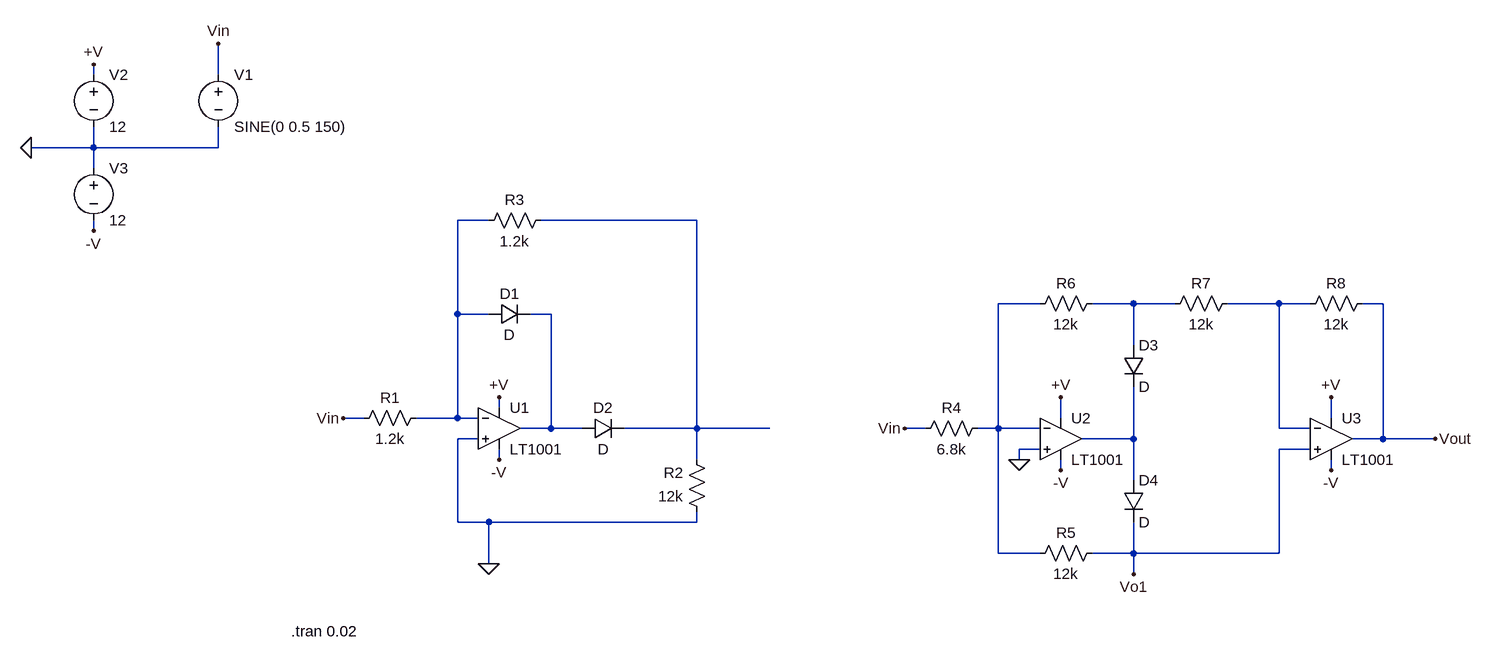
[diagram p0: schematic ckt.asc]
ckt.asc, the LTspice schematic file:
Version 4
SHEET 1 1720 680
WIRE -416 -448 -416 -464
WIRE -224 -448 -224 -496
WIRE -416 -336 -416 -368
WIRE -416 -336 -512 -336
WIRE -224 -336 -224 -368
WIRE -224 -336 -416 -336
WIRE -416 -304 -416 -336
WIRE 192 -224 144 -224
WIRE 512 -224 272 -224
WIRE -416 -208 -416 -224
WIRE 1040 -96 976 -96
WIRE 1184 -96 1120 -96
WIRE 1248 -96 1184 -96
WIRE 1408 -96 1328 -96
WIRE 1456 -96 1408 -96
WIRE 1568 -96 1536 -96
WIRE 144 -80 144 -224
WIRE 192 -80 144 -80
WIRE 288 -80 256 -80
WIRE 1184 -32 1184 -96
WIRE 208 64 208 48
WIRE 0 80 -32 80
WIRE 144 80 144 -80
WIRE 144 80 80 80
WIRE 176 80 144 80
WIRE 1072 80 1072 48
WIRE 1488 80 1488 48
WIRE 288 96 288 -80
WIRE 288 96 240 96
WIRE 336 96 288 96
WIRE 512 96 512 -224
WIRE 512 96 400 96
WIRE 624 96 512 96
WIRE 864 96 832 96
WIRE 976 96 976 -96
WIRE 976 96 944 96
WIRE 1040 96 976 96
WIRE 1408 96 1408 -96
WIRE 1456 96 1408 96
WIRE 176 112 144 112
WIRE 1184 112 1184 32
WIRE 1184 112 1104 112
WIRE 1568 112 1568 -96
WIRE 1568 112 1520 112
WIRE 1648 112 1568 112
WIRE 1040 128 1008 128
WIRE 1456 128 1408 128
WIRE 208 144 208 128
WIRE 512 144 512 96
WIRE 1008 144 1008 128
WIRE 1072 160 1072 144
WIRE 1488 160 1488 144
WIRE 1184 176 1184 112
WIRE 144 240 144 112
WIRE 192 240 144 240
WIRE 512 240 512 224
WIRE 512 240 192 240
WIRE 976 288 976 96
WIRE 1040 288 976 288
WIRE 1184 288 1184 240
WIRE 1184 288 1120 288
WIRE 1408 288 1408 128
WIRE 1408 288 1184 288
WIRE 192 304 192 240
WIRE 1184 320 1184 288
FLAG 208 48 +V
FLAG 208 144 -V
FLAG 192 304 0
FLAG -512 -336 0
FLAG -416 -464 +V
FLAG -416 -208 -V
FLAG -224 -496 Vin
FLAG -32 80 Vin
FLAG 1072 160 -V
FLAG 832 96 Vin
FLAG 1072 48 +V
FLAG 1008 144 0
FLAG 1488 160 -V
FLAG 1488 48 +V
FLAG 1648 112 Vout
FLAG 1184 320 Vo1
SYMBOL Opamps\\LT1001 208 32 R0
SYMATTR InstName U1
SYMBOL res 96 64 R90
WINDOW 0 0 56 VBottom 2
WINDOW 3 32 56 VTop 2
SYMATTR InstName R1
SYMATTR Value 1.2k
SYMBOL diode 192 -64 R270
WINDOW 0 32 32 VTop 2
WINDOW 3 0 32 VBottom 2
SYMATTR InstName D1
SYMBOL diode 336 112 R270
WINDOW 0 32 32 VTop 2
WINDOW 3 0 32 VBottom 2
SYMATTR InstName D2
SYMBOL res 528 240 R180
WINDOW 0 36 76 Left 2
WINDOW 3 36 40 Left 2
SYMATTR InstName R2
SYMATTR Value 12k
SYMBOL res 176 -208 R270
WINDOW 0 32 56 VTop 2
WINDOW 3 0 56 VBottom 2
SYMATTR InstName R3
SYMATTR Value 1.2k
SYMBOL voltage -224 -464 R0
WINDOW 123 0 0 Left 0
WINDOW 39 0 0 Left 0
SYMATTR InstName V1
SYMATTR Value SINE(0 0.5 150)
SYMBOL voltage -416 -464 R0
WINDOW 123 0 0 Left 0
WINDOW 39 0 0 Left 0
SYMATTR InstName V2
SYMATTR Value 12
SYMBOL voltage -416 -320 R0
WINDOW 123 0 0 Left 0
WINDOW 39 0 0 Left 0
SYMATTR InstName V3
SYMATTR Value 12
SYMBOL Opamps\\LT1001 1072 48 R0
SYMATTR InstName U2
SYMBOL res 960 80 R90
WINDOW 0 0 56 VBottom 2
WINDOW 3 32 56 VTop 2
SYMATTR InstName R4
SYMATTR Value 6.8k
SYMBOL Opamps\\LT1001 1488 48 R0
SYMATTR InstName U3
SYMBOL res 1136 272 R90
WINDOW 0 0 56 VBottom 2
WINDOW 3 32 56 VTop 2
SYMATTR InstName R5
SYMATTR Value 12k
SYMBOL res 1136 -112 R90
WINDOW 0 0 56 VBottom 2
WINDOW 3 32 56 VTop 2
SYMATTR InstName R6
SYMATTR Value 12k
SYMBOL res 1344 -112 R90
WINDOW 0 0 56 VBottom 2
WINDOW 3 32 56 VTop 2
SYMATTR InstName R7
SYMATTR Value 12k
SYMBOL res 1552 -112 R90
WINDOW 0 0 56 VBottom 2
WINDOW 3 32 56 VTop 2
SYMATTR InstName R8
SYMATTR Value 12k
SYMBOL diode 1168 -32 R0
SYMATTR InstName D3
SYMBOL diode 1168 176 R0
SYMATTR InstName D4
TEXT -112 408 Left 2 !.tran 0.02

The netlist it stands for:
* ckt.asc
XU1 0 N001 +V -V N006 LT1001  ; pins In+ In- V+ V- OUT
R1 N001 Vin 1.2k
D1 N001 N006 D
D2 N006 N002 D
R2 0 N002 12k
R3 N001 N002 1.2k
V1 Vin 0 SINE(0 0.5 150)
V2 +V 0 12
V3 0 -V 12
XU2 0 N003 +V -V N007 LT1001  ; pins In+ In- V+ V- OUT
R4 N003 Vin 6.8k
XU3 Vo1 N005 +V -V Vout LT1001  ; pins In+ In- V+ V- OUT
R5 Vo1 N003 12k
R6 N004 N003 12k
R7 N005 N004 12k
R8 Vout N005 12k
D3 N004 N007 D
D4 N007 Vo1 D
.model D D
.lib standard.dio
.tran 0.02
.lib LTC.lib
.backanno
.end